# EAGLE design blinkm_mk2j (EAGLE 6.5.0)
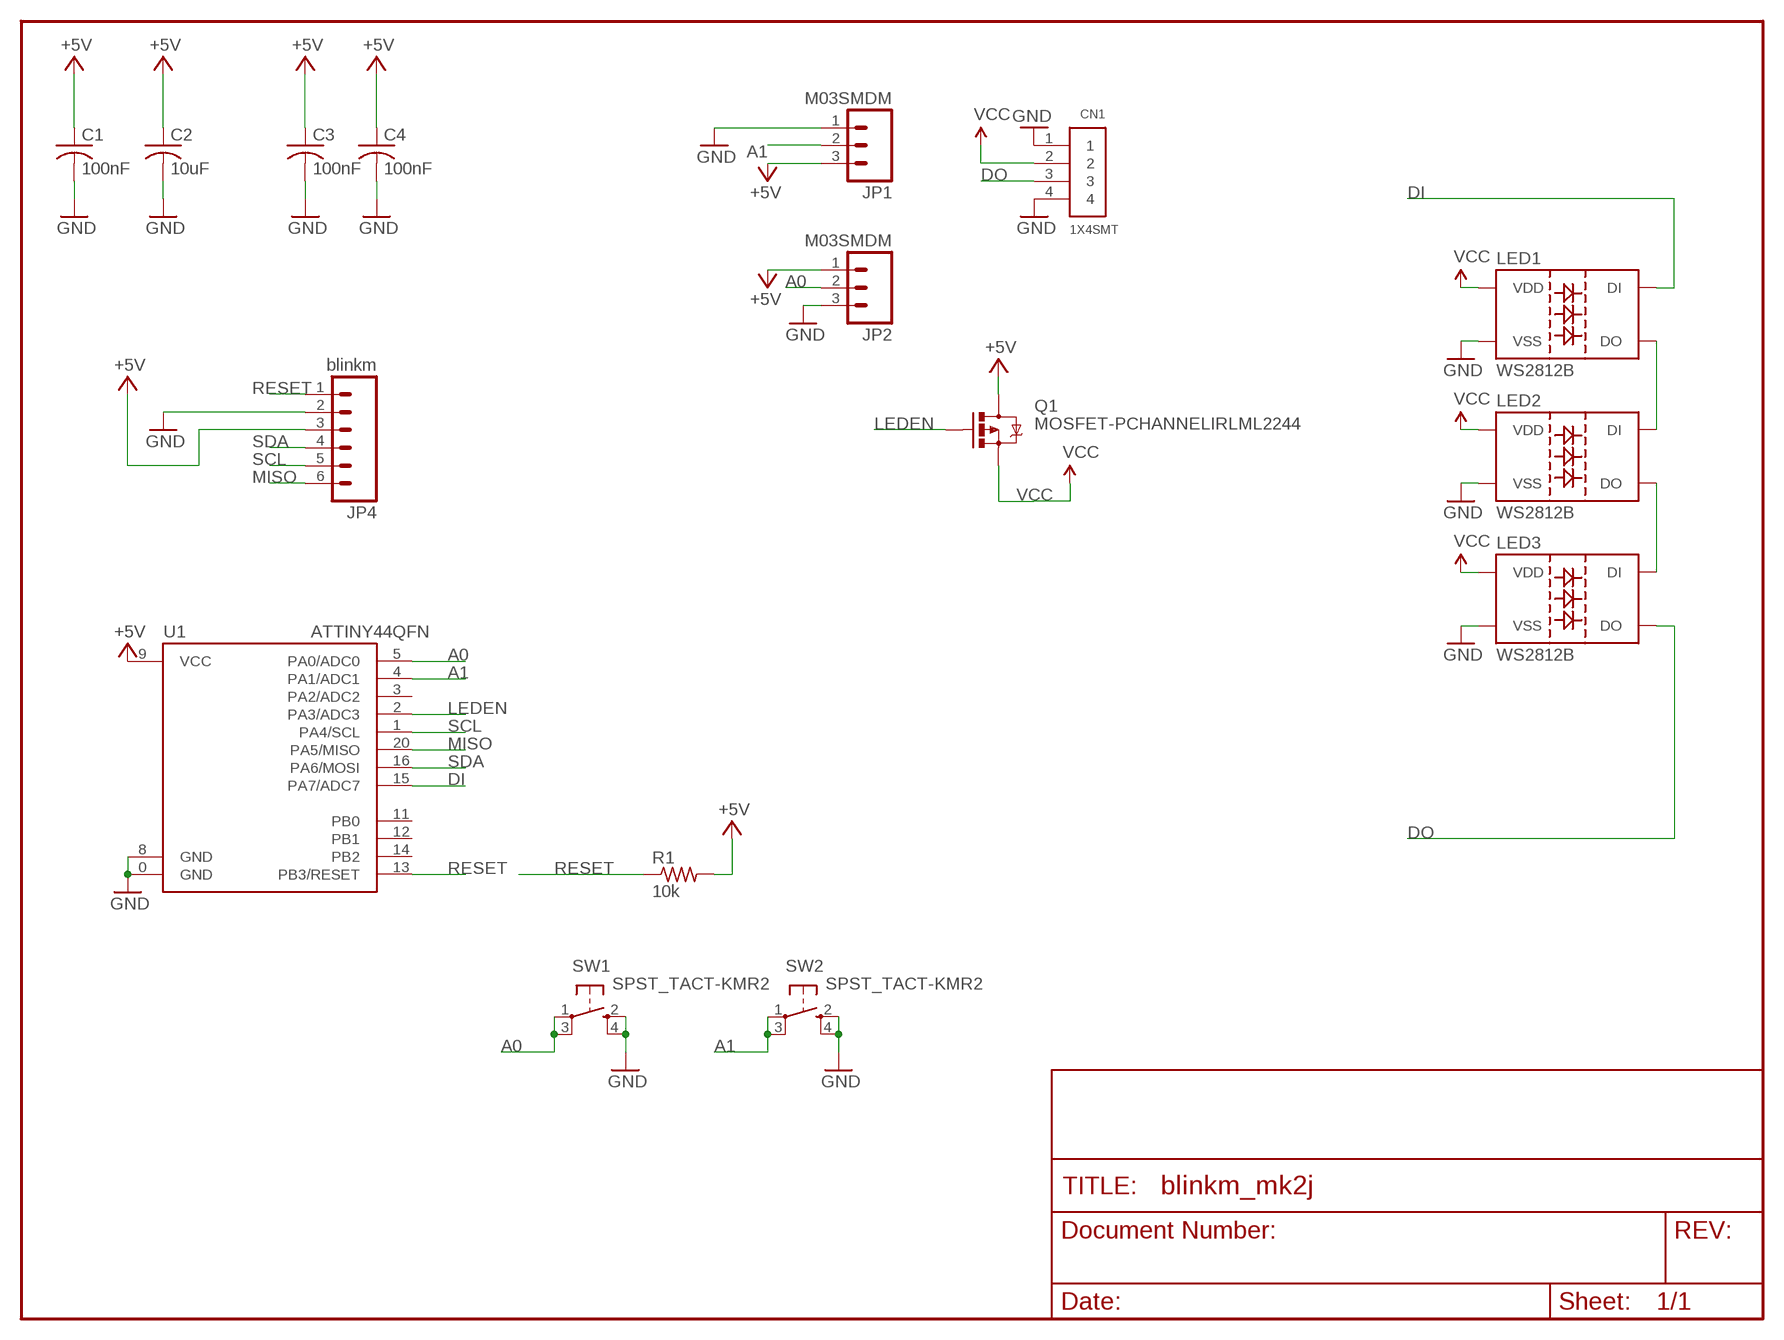
[diagram p0: schematic, sheet 1]

## Parts
C1  100nF  C-USC0603  [C0603]
C2  10uF  C-USC0603  [C0603]
C3  100nF  C-USC0603  [C0603]
C4  100nF  C-USC0603  [C0603]
CN1  1X4SMT  [1X4-SMT]
JP1  M03SMDM  [1X03-SMD-MINIMAL]
JP2  M03SMDM  [1X03-SMD-MINIMAL]
JP4  blinkm  M06LOCK  [1X06_LOCK]
LED1  WS2812B  [WS2812B]
LED2  WS2812B  [WS2812B]
LED3  WS2812B  [WS2812B]
Q1  MOSFET-PCHANNELIRLML2244  [SOT23-3]
R1  10k  R-US_R0603  [R0603]
SW1  SPST_TACT-KMR2  [KMR2]
SW2  SPST_TACT-KMR2  [KMR2]
U1  ATTINY44QFN  ATTINY24QFN  [QFN20]

## Nets
+5V: C1.1 C2.1 C3.1 C4.1 JP1.3 JP2.1 JP4.3 Q1.3(D) R1.2 U1.9(VCC)
A0: JP2.2 SW1.1(P) SW1.3(P1) U1.5(PA0/ADC0)
A1: JP1.2 SW2.1(P) SW2.3(P1) U1.4(PA1/ADC1)
DI: LED1.4(DI) U1.15(PA7/ADC7)
DO: CN1.3 LED3.2(DO)
DOI1: LED1.2(DO) LED2.4(DI)
DOI2: LED2.2(DO) LED3.4(DI)
GND: C1.2 C2.2 C3.2 C4.2 CN1.1 CN1.4 JP1.1 JP2.3 JP4.2 LED1.3(VSS) LED2.3(VSS) LED3.3(VSS) SW1.2(S) SW1.4(S1) SW2.2(S) SW2.4(S1) U1.0(GND) U1.8(GND)
LEDEN: Q1.1(G) U1.2(PA3/ADC3)
MISO: JP4.6 U1.20(PA5/MISO)
RESET: JP4.1 R1.1 U1.13(PB3/RESET)
SCL: JP4.5 U1.1(PA4/SCL)
SDA: JP4.4 U1.16(PA6/MOSI)
VCC: CN1.2 LED1.1(VDD) LED2.1(VDD) LED3.1(VDD) Q1.2(S)
Unconnected: U1.3(PA2/ADC2) U1.11(PB0) U1.12(PB1) U1.14(PB2)

## Library data of the parts
C1-C4 = rcl:C-US: CAPACITOR, American symbol
CN1 = adafruit:1X4: 4-pin connector
JP1 JP2 = todstuff:M03
JP4 = SparkFun-Connectors:M06: Header 6 Standard 6-pin 0.1" header. Use with straight break away headers (SKU : PRT-00116), right angle break away headers (PRT-00553), swiss pins (PRT-00743), machine pins (PRT-00117), and female headers (PRT-00115). Molex polarized connector foot print use with SKU : PRT-08094 with associated crimp pins and housings. NOTES ON THE VARIANTS LOCK and LOCK_LONGPADS... This footprint was designed to help hold the alignment of a through-hole component (i.e. 6-pin header) while soldering it into place. You may notice that each hole has been shifted either up or down by 0.005 of an inch from it's more standard position (which is a perfectly straight line). This slight alteration caused the pins (the squares in the middle) to touch the edges of the holes. Because they are alternating, it causes a "brace" to hold the component in place. 0.005 has proven to be the perfect amount of "off-center" position when using our standard breakaway headers. Although looks a little odd when you look at the bare footprint, once you have a header in there, the alteration is very hard to notice. Also, if you push a header all the way into place, it is covered up entirely on the bottom side. This idea of altering the position of holes to aid alignment will be further integrated into the Sparkfun Library for other footprints. It can help hold any component with 3 or more connection pins.
LED1-LED3 = WS2812:WS2812B
Q1 = SparkFun-DiscreteSemi:MOSFET-PCHANNEL: Generic PMOSFET; PROD_ID: TRANS-11153
R1 = rcl:R-US_: RESISTOR, American symbol
SW1 SW2 = adafruit:SPST_TACT: SMT 6mm switch, EVQQ2 series http://www.ladyada.net/library/eagle
U1 = SparkFun-DigitalIC:ATTINY24: Atmel 20-pin 2kB flash uC

## Board
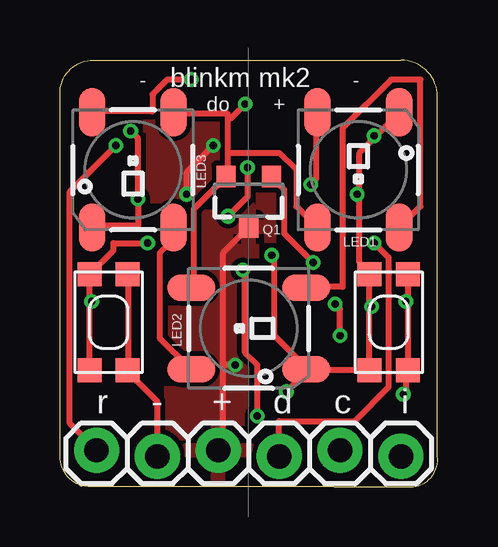
[diagram p1: board, top side]
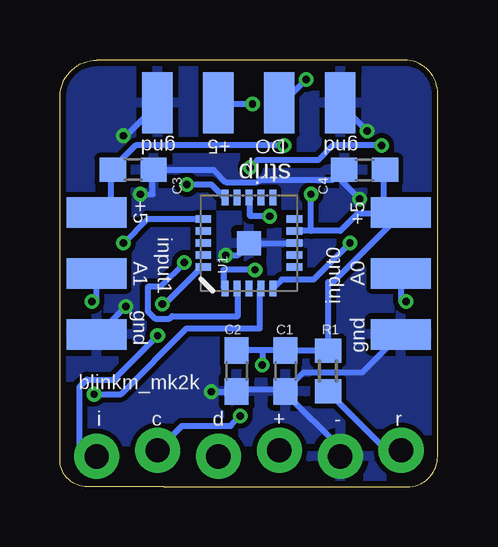
[diagram p2: board, bottom side, seen from below]

Size 15.75 x 17.79 mm. Coordinates in mm from the lower left corner, seen from the top.
Outline: 11.43,0 1.27,0 arc-90 0,1.27 0,16.51 arc-90 1.52,17.78 14.22,17.78 arc-90 15.75,16.26 15.75,1.27 arc-90 14.73,0 11.43,0
Copper layers (1*2*15*16): Top 0.035mm / dielectric 0.2mm / Route2 0.0175mm / dielectric 1.1mm / Route15 0.0175mm / dielectric 0.2mm / Bottom 0.035mm
Design rules "SeeedStudio_DRU_no_angle_20130527 *": minimum track width 10mil, minimum drill 12mil, track to track 8mil, track to pad 6mil, pad to pad 6mil, via to via 6mil, smd to smd 0mil, copper to edge 10mil, drill to drill 10mil, minimum pad ring 6mil, minimum via ring 6mil, stop-mask expansion 2mil, vias tented up to drill 25mil, thermal gap 10mil

### Footprints (pad centres in the part's own frame; a part is rotated, then mirrored left to right if it is on the bottom)
C0603 = smd 1.1 x 1: 1 -0.85,0; 2 0.85,0
1X4-SMT = smd 1.27 x 2.54: 1 -3.81,0; 2 -1.27,0; 3 1.27,0; 4 3.81,0
1X03-SMD-MINIMAL = smd 1.27 x 2.5: 1 -2.54,-0.01; 2 0,-0.01; 3 2.54,-0.01
1X06_LOCK = drill 1.016 pad 1.88: 1 0,0; 2 2.54,-0.254; 3 5.08,0; 4 7.62,-0.254; 5 10.16,0; 6 12.7,-0.254
WS2812B = smd 2 x 1.1: 1 2.4,-1.7; 2 2.4,1.7; 3 -2.4,1.7; 4 -2.4,-1.7
SOT23-3 = smd 0.8 x 0.9: 1 -0.95,-1; 2 0.95,-1; 3 0,1.1
R0603 = smd 1 x 1.1: 1 -0.85,0; 2 0.85,0
KMR2 = smd 1 x 1: 1 2,0.8; 2 2,-0.8; 3 -2,0.8; 4 -2,-0.8
QFN20 = smd 1 x 1: 0 0,0 | smd 0.65 x 0.3: 1 -1.9,1; 2 -1.9,0.5; 3 -1.9,0; 4 -1.9,-0.5; 5 -1.9,-1; 11 1.9,-1; 12 1.9,-0.5; 13 1.9,0; 14 1.9,0.5; 15 1.9,1 | smd 0.3 x 0.65: 6 -1,-1.9; 7 -0.5,-1.9; 8 0,-1.9; 9 0.5,-1.9; 10 1,-1.9; 16 1,1.9; 17 0.5,1.9; 18 0,1.9; 19 -0.5,1.9; 20 -1,1.9

### Placement (x,y rotation side)
C1  6.35,4.83 270 bottom
C2  8.38,4.83 270 bottom
C3  12.7,13.21 0 bottom
C4  3.05,13.21 180 bottom
CN1  7.87,16 0 bottom
JP1  14.22,8.89 90 bottom
JP2  1.52,8.89 270 bottom
JP4  1.52,1.52 0 top
LED1  12.45,13.21 270 top
LED2  7.87,6.6 180 top
LED3  3.05,13.21 90 top
Q1  7.87,11.94 180 top
R1  4.57,4.83 90 bottom
SW1  2.03,6.86 90 top
SW2  13.72,6.86 270 top
U1  7.87,10.16 90 bottom

### Tracks (layer width: path | path; a pad name or v marks a point on that pad's centre or on a via)
+5V  (via drill 0.3)
  Top 0.254: 6.81,5.08 6.81,1.73 JP4.3 | 6.81,5.08 6.81,9.75 7.82,10.77 Q1.3 | v6.4,14.22 5.28,13.11 v5.28,12.19 | v7.32,5.08 6.91,5.08 6.81,5.08
  Bottom 0.254: JP1.3 14.12,11.48 13.61,11.48 13.61,13.21 C3.1 13.51,13.31 12.6,14.22 v6.4,14.22 | 7.32,5.69 6.4,5.69 C1.1 6.3,5.69 R1.2 4.57,5.79 4.57,8.53 4.37,8.53 1.63,11.28 JP2.1 | 7.32,5.69 8.33,5.69 C2.1 | 5.28,10.67 4.06,10.67 3.35,11.38 1.63,11.38 JP2.1 | 5.28,10.67 5.89,10.67 U1.9 | C4.1 2.23,13.21 2.23,11.48 JP2.1 | v5.28,12.19 5.28,10.77 5.28,10.67 | v7.32,5.08 7.32,5.59 7.32,5.69
  pour Top: 19.05,20.32 19.05,0 0,0 0,20.32
A0  (via drill 0.3)
  Top 0.254: v3.66,10.16 2.23,10.16 2.23,9.86 1.32,8.94 SW1.1 1.22,8.74 1.22,7.72 | 1.22,7.72 1.22,4.88 SW1.3 | v1.32,7.72 1.22,7.72
  Bottom 0.254: v3.66,10.16 5.18,8.64 6.5,8.64 6.81,8.33 U1.5 | v1.32,7.72 1.52,7.72 1.52,8.84 JP2.2
A1  (via drill 0.3)
  Top 0.254: v14.33,3.86 14.43,3.96 14.43,4.78 SW2.1 14.53,4.98 14.53,7.72 | 14.53,7.72 14.53,8.84 SW2.3 | v14.43,7.72 14.53,7.72
  Bottom 0.254: v14.33,3.86 13.21,3.86 10.46,6.6 7.42,6.6 7.42,8.23 U1.4 | v14.43,7.72 14.22,7.72 14.22,8.84 JP1.2
DI  (via drill 0.3)
  Top 0.254: v10.46,12.6 10.67,12.8 10.67,15.54 LED1.4
  Bottom 0.254: v10.46,12.6 9.45,12.6 8.94,12.09 U1.15
DO  (via drill 0.3)
  Top 0.254: v5.49,16.97 4.47,16.97 3.86,16.36 3.86,15.65 1.42,15.65 LED3.2
  Bottom 0.254: v5.49,16.97 6.4,16.05 6.6,16.05 CN1.3
DOI1
  Top 0.254: LED2.4 10.36,8.33 11.79,8.33 11.79,14.94 13.82,16.97 15.04,16.97 15.04,11.68 14.22,10.87 LED1.2
DOI2
  Top 0.254: LED2.2 5.38,4.98 4.17,6.2 4.17,9.75 4.67,10.26 4.67,10.77 LED3.4
GND  (via drill 0.3)
  Top 0.254: LED3.3 1.42,10.87 3.25,10.87 v3.25,11.99 3.25,12.09 3.25,14.53 v2.95,14.83 | SW1.2 2.85,8.84 2.85,4.88 SW1.4 2.85,4.78 4.06,3.56 4.06,1.32 JP4.2 | LED2.3 10.36,4.88 12.9,4.88 SW2.2 12.9,4.98 12.9,7.52 | 12.9,7.52 12.9,8.84 SW2.4 12.9,8.94 12.5,9.35 12.5,12.19 | v8.84,9.65 8.94,9.55 8.94,6.3 10.26,4.98 LED2.3 | 13.16,14.58 12.5,13.92 12.5,12.19 | 13.16,14.58 14.12,15.54 LED1.3 | v13.01,7.52 12.9,7.52 | v13.11,14.63 13.16,14.58 | v9.45,3.96 10.26,4.78 LED2.3 | v12.39,12.19 12.5,12.19
  Bottom 0.254: v3.25,11.99 4.17,12.9 C4.2 3.96,13.21 4.37,12.8 7.42,12.8 7.52,12.7 8.84,12.7 9.35,13.21 11.79,13.21 C3.2 11.89,13.11 11.89,12.19 v12.39,12.19 | v2.95,14.83 4.06,15.95 CN1.4 | C1.2 6.4,4.06 8.33,4.06 C2.2 8.43,3.96 v9.45,3.96 | C1.2 6.3,3.86 4.06,1.63 4.06,1.32 JP4.2 | JP2.3 1.63,6.3 3.15,4.78 5.59,4.78 6.3,4.06 C1.2 | U1.8 5.99,10.16 7.82,10.16 U1.0 7.92,10.06 8.33,9.65 v8.84,9.65 | v13.01,7.52 14.12,6.4 JP1.1 | v13.11,14.63 13.01,14.63 11.68,15.95 CN1.1
  pour Bottom: 0,19.05 0,0 17.78,0 17.78,19.05
LEDEN  (via drill 0.3)
  Top 0.254: v10.57,9.35 9.35,10.57 9.35,12.39 8.84,12.9 Q1.1
  Bottom 0.254: v10.57,9.35 11.58,8.33 12.09,8.33 12.09,7.32 11.79,7.01 11.18,7.01 11.07,7.11 8.33,7.11 8.33,8.23 U1.2
MISO  (via drill 0.3)
  Top 0.254: v11.48,7.62 11.68,7.42 v11.68,6.3
  Bottom 0.254: v11.48,7.62 11.38,7.62 9.86,9.14 U1.20 | v11.68,6.3 13.51,4.47 14.63,4.47 14.94,4.17 14.94,1.32 14.22,1.32 JP4.6
RESET  (via drill 0.3)
  Top 0.254: v7.01,11.28 7.82,12.09 v7.82,13.31 | v2.34,14.22 0.41,12.29 0.41,2.64 JP4.1
  Bottom 0.254: v7.01,11.28 7.82,11.28 7.82,11.99 U1.13 | v7.82,13.31 7.52,13.61 4.98,13.61 4.37,14.22 v2.34,14.22 | JP4.1 2.13,1.52 4.57,3.96 R1.1
SCL  (via drill 0.3)
  Top 0.254: v7.62,9.04 7.72,8.94 7.72,5.59 8.23,5.08 v8.23,2.95
  Bottom 0.254: v7.62,9.04 8.94,9.04 8.94,8.33 U1.1 | v8.23,2.95 8.64,2.54 10.67,2.54 JP4.5
SDA  (via drill 0.3)
  Top 0.254: v13.11,10.16 13.72,9.55 13.72,4.17 12.29,2.74 9.14,2.74 9.14,1.32 JP4.4
  Bottom 0.254: v13.11,10.16 12.09,11.18 9.86,11.18 U1.16
VCC  (via drill 0.3)
  Top 0.254: LED2.1 5.49,8.33 5.59,8.43 5.59,11.58 6.91,12.9 Q1.2 7.01,13.01 7.01,13.92 | 7.01,13.92 9.14,13.92 9.86,13.21 9.86,11.68 10.67,10.87 LED1.1 | 7.01,15.34 7.01,14.02 7.01,13.92 | 7.01,15.34 7.01,15.54 4.78,15.54 LED3.1 | v7.72,15.95 7.11,15.34 7.01,15.34
  Bottom 0.254: v7.72,15.95 9.14,15.95 CN1.2

### Text on the board
tPlace: - | blinkm mk2 | - | do | + | r | - | + | d | c | i
bPlace: gnd | DO | +5 | gnd | strip | +5 | +5 | input1 | A1 | A0 | input0 | gnd | gnd | blinkm_mk2k | r | - | + | d | c | i